# Altium project PCB_Project.PrjPcb
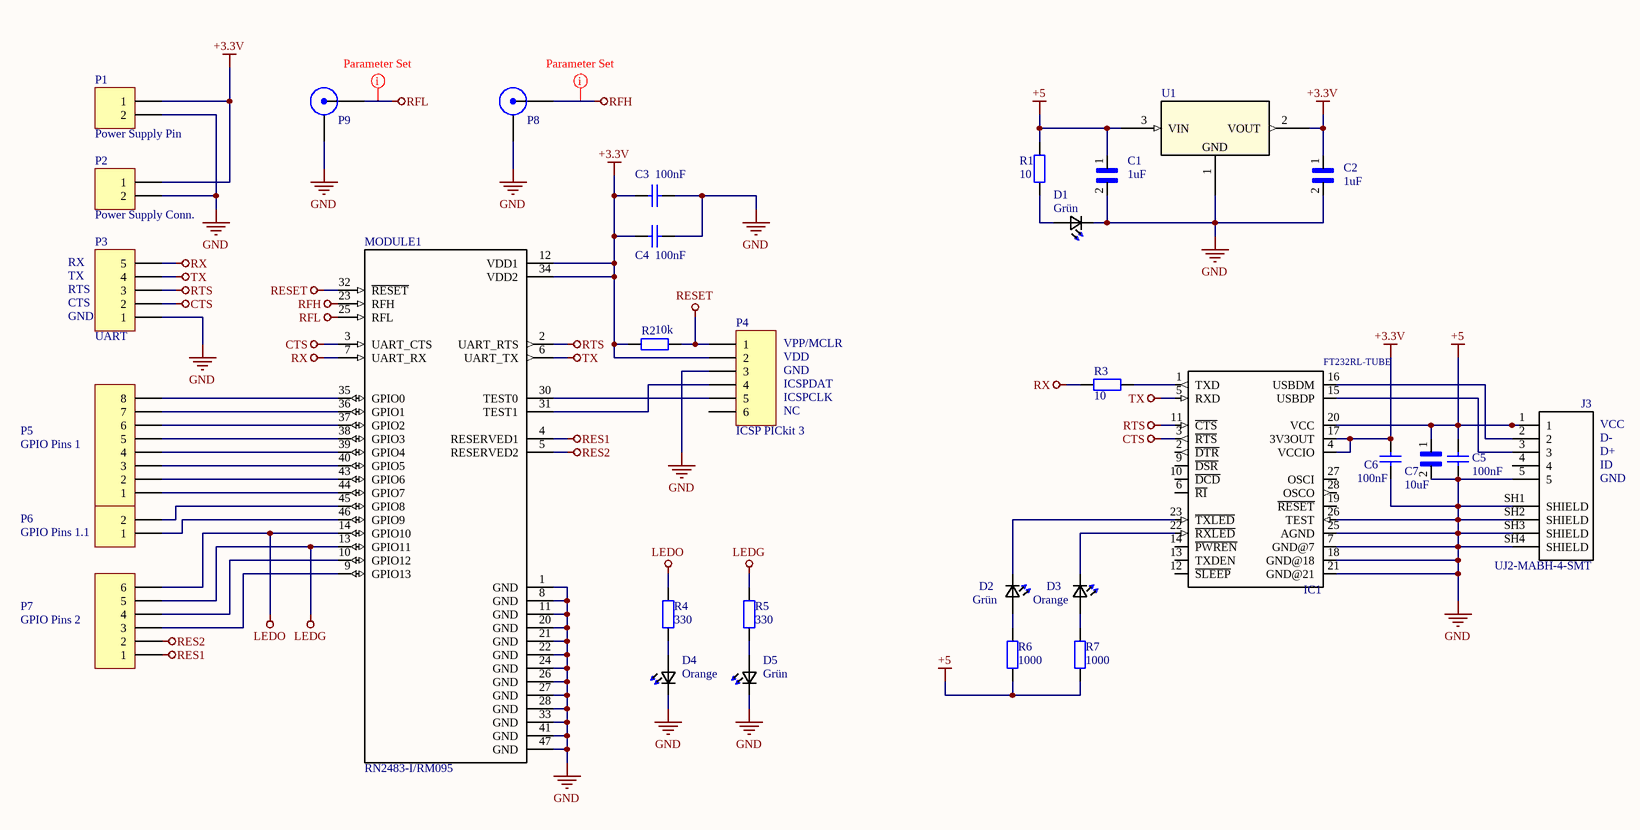
[diagram p0: Funk.SchDoc]
1 sheet, 32 parts. Net scope: global (net labels, ports and power ports of the same name join across sheets).
Board file: Funk.PcbDoc

## Sheet Funk.SchDoc: LoRa Modul
size A3; Date: 07.09.2019; DrawnBy: Marco Stauber; Organization: TechStaff IDSC; DocumentNumber: 1; Revision: 1; SheetNumber: 1; SheetTotal: 1

### Parts
C1  1uF  [*CAPC2012X135N]
C2  1uF  [*CAPC2012X135N]
C3  100nF  [CAP_0603i_1608m -L]
C4  100nF  [CAP_0603i_1608m -L]
C5  100nF  [CAP_0603i_1608m -L]
C6  100nF  [CAP_0603i_1608m -L]
C7  10uF  [*CAPC2012X135N]
D1  Grün  [*0603]
D2  Grün  [*0603]
D3  Orange  [*0603]
D4  Orange  [*0603]
D5  Grün  [*0603]
IC1  FT232RL-TUBE  [*SSOP28-LD]  (value not drawn)
J3  UJ2-MABH-4-SMT  [*CUI_UJ2-MABH-4-SMT_UJ2-MABH-4-SMT(Primary)]
MODULE1  RN2483-I/RM095  [*MICROCHIP_RN2483-I/RM095]
P1  Power Supply Pin  [HDR1X2]
P2  Power Supply Conn.  [3.5MM Phoenix Contact 1984617]
P3  UART  [HDR1X5]
P4  ICSP PICkit 3  [HDR1X6]
P5  GPIO Pins 1  [HDR1X8]
P6  GPIO Pins 1.1  [HDR1X2]
P7  GPIO Pins 2  [HDR1X6]
P8  Hirose U.FL-R-SMT-1(10)  [Hirsoe U.FL-R-SMT-1(10)]  (value not drawn)
P9  Hirose U.FL-R-SMT-1(10)  [Hirsoe U.FL-R-SMT-1(10)]  (value not drawn)
R1  10  [RES_0603i_1608m -N]
R2  10k  [RES_0603_1608m -L]
R3  10  [RES_0603i_1608m -N]
R4  330  [RES_0603i_1608m -N]
R5  330  [RES_0603i_1608m -N]
R6  1000  [RES_0603i_1608m -N]
R7  1000  [RES_0603i_1608m -N]
U1  Part Number: AP2120N-3.3TRG1  [SOT-23-M]  (value not drawn)

### Nets
+3.3V: C2.1 C3.2 C4.2 C6.2 IC1.4(VCCIO) IC1.17(3V3OUT) MODULE1.12(VDD1) MODULE1.34(VDD2) P1.1 P2.1 P4.2 R2.1 U1.2(VOUT)
+5: C1.1 C5.2 C7.1 IC1.20(VCC) J3.1 R1.1 R6.1 R7.1 U1.3(VIN)
CTS: IC1.3(~{RTS}) MODULE1.3(UART_CTS) P3.2
GND: C1.2 C2.2 C3.1 C4.1 C5.1 C6.1 C7.2 D1.1(K2) D4.1(K2) D5.1(K2) IC1.7(GND@7) IC1.18(GND@18) IC1.21(GND@21) IC1.25(AGND) IC1.26(TEST) J3.5 J3.SH1(SHIELD) J3.SH2(SHIELD) J3.SH3(SHIELD) J3.SH4(SHIELD) MODULE1.1(GND) MODULE1.8(GND) MODULE1.11(GND) MODULE1.20(GND) MODULE1.21(GND) MODULE1.22(GND) MODULE1.24(GND) MODULE1.26(GND) MODULE1.27(GND) MODULE1.28(GND) MODULE1.33(GND) MODULE1.41(GND) MODULE1.47(GND) P1.2 P2.2 P3.1 P4.3 P8.2 P9.2 U1.1(GND)
LEDG: MODULE1.13(GPIO11) P7.5 R5.2
LEDO: MODULE1.14(GPIO10) P7.6 R4.2
RES1: MODULE1.4(RESERVED1) P7.1
RES2: MODULE1.5(RESERVED2) P7.2
RESET: MODULE1.32(~{RESET}) P4.1 R2.2
RFH: MODULE1.23(RFH) P8.1
RFL: MODULE1.25(RFL) P9.1
RTS: IC1.11(~{CTS}) MODULE1.2(UART_RTS) P3.3
RX: MODULE1.7(UART_RX) P3.5 R3.2
TX: IC1.5(RXD) MODULE1.6(UART_TX) P3.4
NetD1_2: D1.2(A2) R1.2
NetD2_1: D2.1(K2) IC1.23(~{TXLED})
NetD2_2: D2.2(A2) R6.2
NetD3_1: D3.1(K2) IC1.22(~{RXLED})
NetD3_2: D3.2(A2) R7.2
NetD4_2: D4.2(A2) R4.1
NetD5_2: D5.2(A2) R5.1
NetIC1_1: IC1.1(TXD) R3.1
NetIC1_15: IC1.15(USBDP) J3.3
NetIC1_16: IC1.16(USBDM) J3.2
NetMODULE1_9: MODULE1.9(GPIO13) P7.3
NetMODULE1_10: MODULE1.10(GPIO12) P7.4
NetMODULE1_30: MODULE1.30(TEST0) P4.5
NetMODULE1_31: MODULE1.31(TEST1) P4.4
NetMODULE1_35: MODULE1.35(GPIO0) P5.8
NetMODULE1_36: MODULE1.36(GPIO1) P5.7
NetMODULE1_37: MODULE1.37(GPIO2) P5.6
NetMODULE1_38: MODULE1.38(GPIO3) P5.5
NetMODULE1_39: MODULE1.39(GPIO4) P5.4
NetMODULE1_40: MODULE1.40(GPIO5) P5.3
NetMODULE1_43: MODULE1.43(GPIO6) P5.2
NetMODULE1_44: MODULE1.44(GPIO7) P5.1
NetMODULE1_45: MODULE1.45(GPIO8) P6.2
NetMODULE1_46: MODULE1.46(GPIO9) P6.1

Not connected (* = marked no-connect by the designer): IC1 2(~{DTR}) 6(~{RI}) 9(~{DSR}) 10(~{DCD}) 12(~{SLEEP}) 13(TXDEN) 14(~{PWREN}) 19(~{RESET}) 27(OSCI) 28(OSCO); J3 4; P4 6

### Layout directives
rule Impedance Constraint [Min = 50.00    Max = 50.00    ]: RFH, RFL

### Notes on the sheet
- (near P3) GND
- (near P3) CTS
- (near P3) RTS
- TX
- RX
- (near P4) VPP/MCLR
- (near P4) VDD
- (near P4) GND
- (near P4) NC
- (near P4) ICSPCLK
- (near P4) ICSPDAT
- VCC
- D-
- D+
- ID
- GND
- 1
- 2
- 3
- 4
- 5
- 6
- 7
- 8
- A
- B
- C
- D
- Project:
- Date:
- Drawing number:
- Rev:
- Format:
- A3
- Drawn by:
- Laboratory:
- Page
- Sheet:
- of
- File:

### Library data of the parts
C1 C2 C7 = CL21A106KPFNNNG: MF: Samsung Electro-Mechanics; Digi-Key_Part_Number: 1276-6456-1-ND; Digi-Key_Purchase_URL: https://www.digikey.com/product-detail/en/samsung-electro-mechanics/CL21A106KPFNNNG/1276-6456-1-ND/5958084?utm_source=snapeda&utm_medium=aggregator&utm_campaign=symbol; SnapEDA_Link: https://www.snapeda.com/parts/CL21A106KPFNNNG/Samsung%20Electro-Mechanics/view-part/?ref=snap; MP: CL21A106KPFNNNG; Package: 0805 Samsung; Value: *
C3-C6 = Cap: capacitor
D1 D2 D5 = LTST-C191KGKT: / LED; SMD; 0603; grün; 35mcd; 1.6x0.8x0.55mm; 130Â°; 2Ã·2.V; 20mA /; MF: Lite-On Inc.; Digi-Key_Purchase_URL: https://www.digikey.ch/product-detail/de/lite-on-inc/LTST-C191KGKT/160-1446-1-ND/386834; SnapEDA_Link: https://www.snapeda.com/parts/LTST-C191KFKT/Lite-On%20Inc./view-part/?ref=snap; MP: LTST-C191KGKT; Digi-Key_Part_Number: 160-1446-1-ND; Package: 0603 Lite-On; Value: *
D3 D4 = LTST-C191KFKT: / LED; SMD; 0603; orange; 45-90mcd; 1.6x0.8x0.55mm; 130Â°; 2Ã·2.4V; 20mA /; MF: Lite-On Inc.; Digi-Key_Purchase_URL: https://www.digikey.com/product-detail/en/lite-on-inc/LTST-C191KFKT/160-1445-1-ND/386832?utm_source=snapeda&utm_medium=aggregator&utm_campaign=symbol; SnapEDA_Link: https://www.snapeda.com/parts/LTST-C191KFKT/Lite-On%20Inc./view-part/?ref=snap; MP: LTST-C191KFKT; Digi-Key_Part_Number: 160-1445-1-ND; Package: 0603 Lite-On; Value: *
IC1 = FT232RL-TUBE: USB-to-UART 1-CH 256byte FIFO 5V 28-Pin SSOP Tube; MF: FTDI,; Digi-Key_Part_Number: 768-1306-ND; Package: SSOP-28 FTDI; Digi-Key_Purchase_URL: https://www.digikey.com/product-detail/en/ftdi-future-technology-devices-international-ltd/FT232RL-TUBE/768-1306-ND/4006920?utm_source=snapeda&utm_medium=aggregator&utm_campaign=symbol; SnapEDA_Link: https://www.snapeda.com/parts/FT232RL-TUBE/FTDI%2C%20Future%20Technology%20Devices%20International%20Ltd/view-part/?ref=snap; MP: FT232RL-TUBE; Value: *
J3 = UJ2-MABH-4-SMT: Mini AB, USB 2.0, 1 A, Right Angle, Surface Mount _SMT_, USB Receptacle; MF: CUI Inc.; Digi-Key_Part_Number: 102-5890-1-ND; Package: None; Digi-Key_Purchase_URL: https://www.digikey.com/product-detail/en/cui-inc/UJ2-MABH-4-SMT-TR/102-5890-1-ND/9838992?utm_source=snapeda&utm_medium=aggregator&utm_campaign=symbol; CUI_purchase_URL: https://www.cui.com/product/interconnect/connectors/usb-connectors/uj2-mabh-smt-series?utm_source=snapeda.com&utm_medium=referral&utm_campaign=snapedaBOM; SnapEDA_Link: https://www.snapeda.com/parts/UJ2-MABH-4-SMT/CUI%20Inc./view-part/?ref=snap; MP: UJ2-MABH-4-SMT; Value: *
MODULE1 = RN2483-I/RM095: Sub-GHz Dual Band Long Range Transceiver LoRa Module; MF: Microchip; Availability: Unavailable; Package: None; SnapEDA_Link: https://www.snapeda.com/parts/RN2483-I/RM095/Microchip/view-part/?ref=snap; MP: RN2483-I/RM095; Price: None; Value: *
P1 P2 P6 = Header 2: Header, 2-Pin
P3 = Header 5: Header, 5-Pin
P4 P7 = Header 6: Header, 6-Pin
P5 = Header 8: Header, 8-Pin
P8 P9 = Hirose U.FL-R-SMT-1(10): U.FL
R1-R7 = Res: Resistor
U1 = AP2120N-3.3TRG1: No Description Available; Vendor: Diodes Inc; Built_By: EMA_UL_Team; Manufacturer_Part_Number: AP2120N-3.3TRG1; Copyright: Copyright (C) 2018 Accelerated Designs. All rights reserved; RefDes: RefDes; Type: DEV; Value: Value